# Altium project IR_robottino.PrjPCB
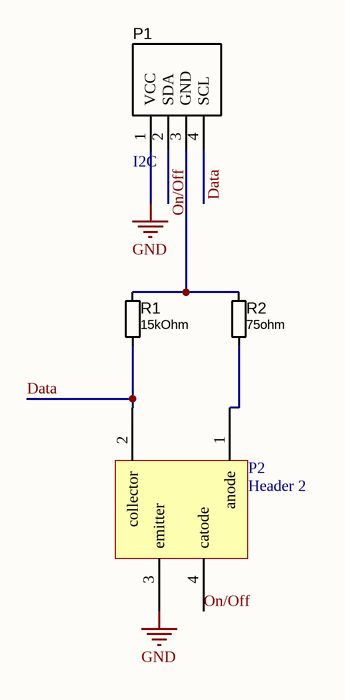
[diagram p0: IR_robottino_schematics.SchDoc]
1 sheet, 4 parts. Net scope: global (net labels, ports and power ports of the same name join across sheets).
Board files: IR_robottino_PCB2.PcbDoc, IR_robottino_PCB.PcbDoc

## Sheet IR_robottino_schematics.SchDoc
size A4

### Parts
P1  I2C  [TYCO/215079-4]
P2  Header 2  [TCRT 5000]
R1  15kOhm  [R/0805]
R2  75ohm  [R/1206]

### Nets
GND: P1.1(VCC) P2.3(emitter)
Data: P1.4(SCL) P2.2(collector) R1.1
On/Off: P1.2(SDA) P2.4(catode)
NetP1_3: P1.3(GND) R1.2 R2.2
NetP2_1: P2.1(anode) R2.1

### Library data of the parts
P1 = Micromatch-I2C: Micromatch I2C Connector
P2 = TCRT 5000: Header, 2-Pin; LatestRevisionDate: 17-Jul-2002; LatestRevisionNote: Re-released for DXP Platform.; Publisher: Altium Limited
R1 R2 = R: Resistor; Published: 8-Jun-2000; LatestRevisionDate: 17-Jul-2002; LatestRevisionNote: Re-released for DXP Platform.; PackageReference: AXIAL-0.4; Publisher: Altium Limited
  R1: Value: 15kOhm
  R2: Value: 75ohm